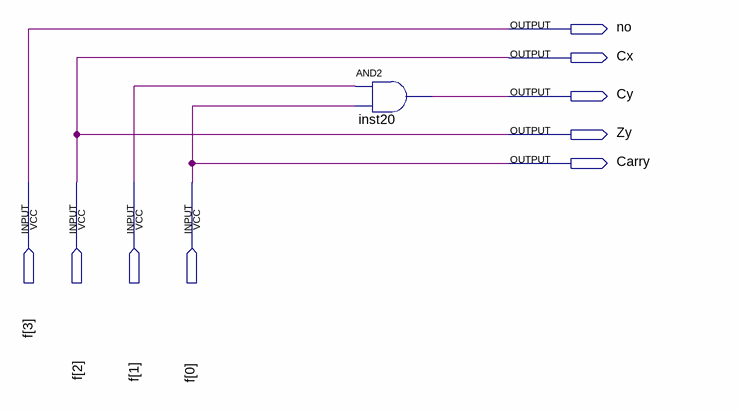
[diagram p0: schematic sheet]
// Quartus schematic Decodificador.bdf as structural Verilog: 1 symbols, 9 pins
module Decodificador (
  input  [3:0] f,
  output no,
  output Cx,
  output Cy,
  output Zy,
  output Carry
);

  and inst20 (Cy, f[1], f[0]);

  assign Carry = f[0];
  assign Cx = f[2];
  assign no = f[3];
  assign Zy = f[2];
endmodule
